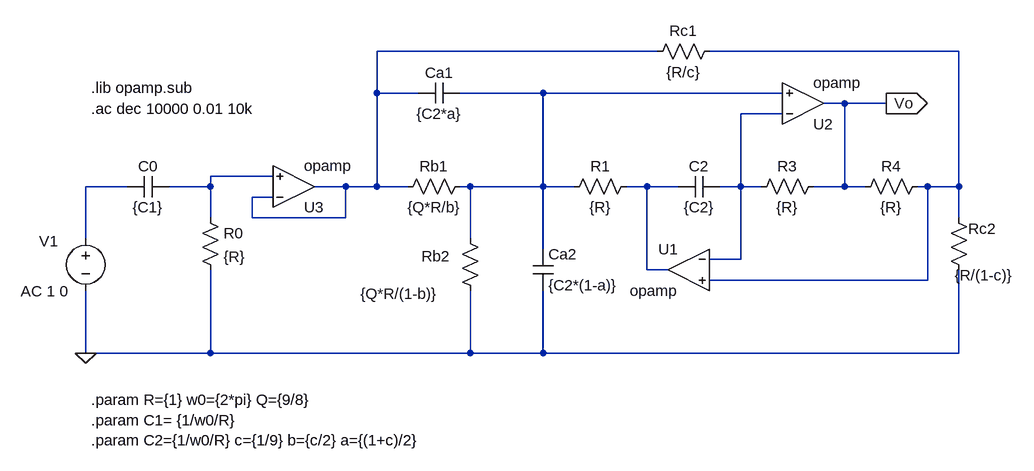
[diagram p0: schematic pasaalto_notch_schaumann.asc]
pasaalto_notch_schaumann.asc, the LTspice schematic file:
Version 4
SHEET 1 1408 680
WIRE 848 -48 416 -48
WIRE 1312 -48 928 -48
WIRE 416 16 416 -48
WIRE 480 16 416 16
WIRE 672 16 544 16
WIRE 1040 16 672 16
WIRE 1136 32 1104 32
WIRE 1200 32 1136 32
WIRE 1040 48 976 48
WIRE 256 144 160 144
WIRE 32 160 -32 160
WIRE 160 160 160 144
WIRE 160 160 96 160
WIRE 368 160 320 160
WIRE 416 160 416 16
WIRE 416 160 368 160
WIRE 464 160 416 160
WIRE 560 160 544 160
WIRE 672 160 672 16
WIRE 672 160 560 160
WIRE 720 160 672 160
WIRE 832 160 800 160
WIRE 880 160 832 160
WIRE 976 160 976 48
WIRE 976 160 944 160
WIRE 1008 160 976 160
WIRE 1136 160 1136 32
WIRE 1136 160 1088 160
WIRE 1168 160 1136 160
WIRE 1264 160 1248 160
WIRE 1312 160 1312 -48
WIRE 1312 160 1264 160
WIRE 256 176 224 176
WIRE 160 208 160 160
WIRE 224 208 224 176
WIRE 368 208 368 160
WIRE 368 208 224 208
WIRE 1312 208 1312 160
WIRE -32 240 -32 160
WIRE 560 240 560 160
WIRE 672 256 672 160
WIRE 976 272 976 160
WIRE 976 272 928 272
WIRE 832 288 832 160
WIRE 864 288 832 288
WIRE 1264 304 1264 160
WIRE 1264 304 928 304
WIRE -32 416 -32 320
WIRE 160 416 160 288
WIRE 160 416 -32 416
WIRE 560 416 560 320
WIRE 560 416 160 416
WIRE 672 416 672 320
WIRE 672 416 560 416
WIRE 1312 416 1312 288
WIRE 1312 416 672 416
FLAG 1200 32 Vo
IOPIN 1200 32 Out
FLAG -32 416 0
SYMBOL cap 96 144 R90
WINDOW 0 0 32 VBottom 2
WINDOW 3 32 32 VTop 2
SYMATTR InstName C0
SYMATTR Value {C1}
SYMBOL res 144 192 R0
SYMATTR InstName R0
SYMATTR Value {R}
SYMBOL res 1328 304 R180
WINDOW 0 -41 79 Left 2
WINDOW 3 -68 8 Left 2
SYMATTR InstName Rc2
SYMATTR Value {R/(1-c)}
SYMBOL res 816 144 R90
WINDOW 0 0 56 VBottom 2
WINDOW 3 32 56 VTop 2
SYMATTR InstName R1
SYMATTR Value {R}
SYMBOL res 1264 144 R90
WINDOW 0 0 56 VBottom 2
WINDOW 3 32 56 VTop 2
SYMATTR InstName R4
SYMATTR Value {R}
SYMBOL res 1104 144 R90
WINDOW 0 0 56 VBottom 2
WINDOW 3 32 56 VTop 2
SYMATTR InstName R3
SYMATTR Value {R}
SYMBOL cap 944 144 R90
WINDOW 0 0 32 VBottom 2
WINDOW 3 32 32 VTop 2
SYMATTR InstName C2
SYMATTR Value {C2}
SYMBOL OpAmps\\opamp 896 224 M0
SYMATTR InstName U1
SYMBOL OpAmps\\opamp 1072 96 M180
SYMATTR InstName U2
SYMBOL voltage -32 224 R0
WINDOW 0 -72 20 Left 2
WINDOW 123 -100 97 Left 2
WINDOW 39 0 0 Left 0
SYMATTR InstName V1
SYMATTR Value2 AC 1 0
SYMATTR Value ""
SYMBOL OpAmps\\opamp 288 224 M180
SYMATTR InstName U3
SYMBOL cap 656 256 R0
SYMATTR InstName Ca2
SYMATTR Value {C2*(1-a)}
SYMBOL res 544 224 R0
WINDOW 0 -59 43 Left 2
WINDOW 3 -153 101 Left 2
SYMATTR InstName Rb2
SYMATTR Value {Q*R/(1-b)}
SYMBOL res 560 144 R90
WINDOW 0 0 56 VBottom 2
WINDOW 3 32 56 VTop 2
SYMATTR InstName Rb1
SYMATTR Value {Q*R/b}
SYMBOL cap 544 0 R90
WINDOW 0 0 32 VBottom 2
WINDOW 3 32 32 VTop 2
SYMATTR InstName Ca1
SYMATTR Value {C2*a}
SYMBOL res 944 -64 R90
WINDOW 0 0 56 VBottom 2
WINDOW 3 32 56 VTop 2
SYMATTR InstName Rc1
SYMATTR Value {R/c}
TEXT -24 8 Left 2 !.lib opamp.sub
TEXT -24 40 Left 2 !.ac dec 10000 0.01 10k
TEXT -24 488 Left 2 !.param R={1} w0={2*pi} Q={9/8}\n.param C1= {1/w0/R}\n.param C2={1/w0/R} c={1/9} b={c/2} a={(1+c)/2}

The netlist it stands for:
* pasaalto_notch_schaumann.asc
C0 N005 N006 {C1}
R0 N005 0 {R}
Rc2 0 N002 {R/(1-c)}
R1 N007 N003 {R}
R4 N002 Vo {R}
R3 Vo N004 {R}
C2 N004 N007 {C2}
XU1 N004 N002 N007 opamp Aol=100K GBW=10Meg  ; pins invin noninvin out
XU2 N004 N003 Vo opamp Aol=100K GBW=10Meg  ; pins invin noninvin out
V1 N006 0 AC 1 0
XU3 N001 N005 N001 opamp Aol=100K GBW=10Meg  ; pins invin noninvin out
Ca2 N003 0 {C2*(1-a)}
Rb2 N003 0 {Q*R/(1-b)}
Rb1 N003 N001 {Q*R/b}
Ca1 N003 N001 {C2*a}
Rc1 N002 N001 {R/c}
.lib opamp.sub
.ac dec 10000 0.01 10k
.param R={1} w0={2*pi} Q={9/8}
.param C1= {1/w0/R}
.param C2={1/w0/R} c={1/9} b={c/2} a={(1+c)/2}
.backanno
.end